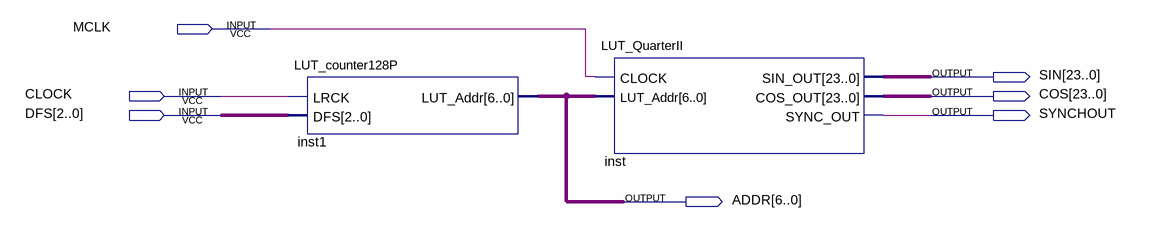
[diagram p0: schematic sheet]
// Quartus schematic TestLUT_128.bdf as structural Verilog: 2 symbols, 7 pins
module TestLUT_128 (
  input  MCLK,
  input  CLOCK,
  input  [2:0] DFS,
  output [23:0] SIN,
  output [23:0] COS,
  output SYNCHOUT,
  output [6:0] ADDR
);

  LUT_counter128P inst1 (.LRCK(CLOCK), .DFS(DFS), .LUT_Addr(ADDR));
  LUT_QuarterII inst (.CLOCK(MCLK), .LUT_Addr(ADDR), .SIN_OUT(SIN), .COS_OUT(COS), .SYNC_OUT(SYNCHOUT));
endmodule
